# Altium project Thunderscope_Rev3.PrjPCB (part 2 of 2)
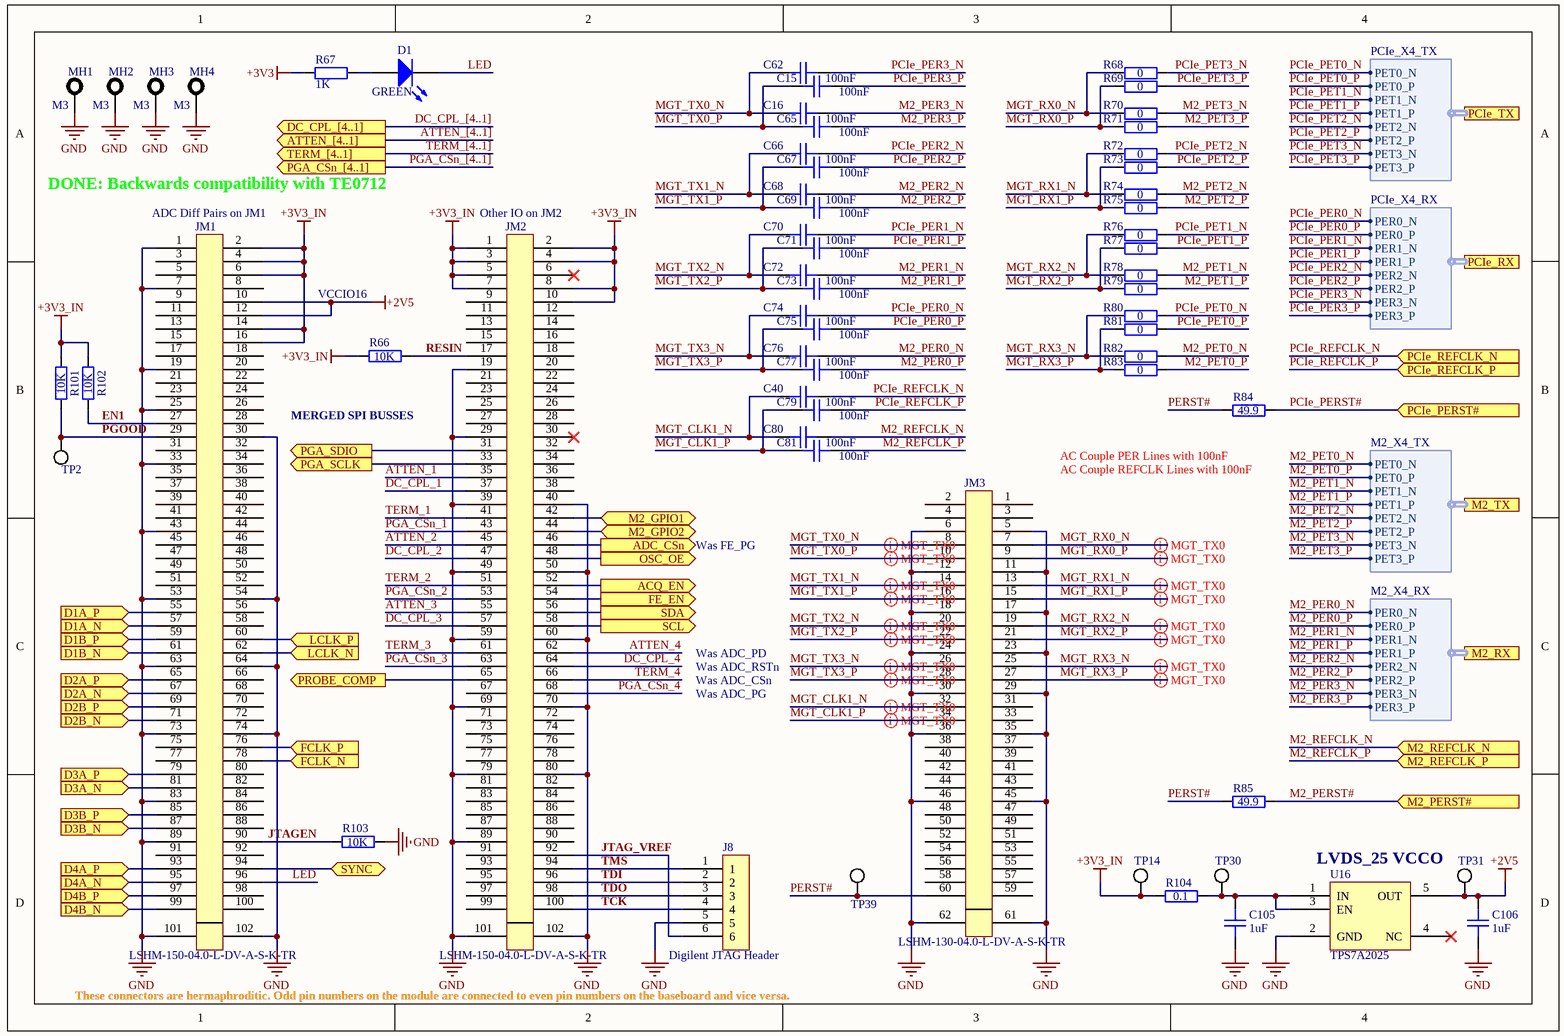
[diagram p5: FPGA.SchDoc]

## Nets that join several sheets
+3V3: Main (7 pins), FE (6 pins), Front End/CH1 (7 pins), Front End/CH2 (7 pins), Front End/CH3 (7 pins), Front End/CH4 (7 pins), ADC (9 pins), FPGA (R67.2)
+3V3_IN: Main (C91.2 U14.1 U14.2 U14.4), FPGA (18 pins)
+5V: FE (16 pins), Front End/CH1 (17 pins), Front End/CH2 (17 pins), Front End/CH3 (17 pins), Front End/CH4 (17 pins)
+5V2: Main (R4.2 TP4.1), FE (R7.1 R8.1 TP13.1)
-5V: FE (5 pins), Front End/CH1 (13 pins), Front End/CH2 (13 pins), Front End/CH3 (13 pins), Front End/CH4 (13 pins)
-VBIAS: FE (TP19.1 U5.2 U5.6), Front End/CH1 (C28A.1 R47A.1), Front End/CH2 (C28B.1 R47B.1), Front End/CH3 (C28C.1 R47C.1), Front End/CH4 (C28D.1 R47D.1)
GND: Main (29 pins), FE (32 pins), Front End/CH1 (46 pins), Front End/CH2 (46 pins), Front End/CH3 (46 pins), Front End/CH4 (46 pins), ADC (34 pins), FPGA (57 pins)
ACQ_EN: Main (R38.2 TP33.1 U14.3), FPGA (JM2.52)
ADC_CSn: ADC (R42.1 TP29.1 U12.2), FPGA (JM2.46)
ADC_SCLK: Front End/CH1 (U7A.11), Front End/CH2 (U7B.11), Front End/CH3 (U7C.11), Front End/CH4 (U7D.11), ADC (TP35.1 U12.4), FPGA (JM2.33)
ADC_SDATA: Front End/CH1 (U7A.10), Front End/CH2 (U7B.10), Front End/CH3 (U7C.10), Front End/CH4 (U7D.10), ADC (TP34.1 U12.3), FPGA (JM2.31)
ATTEN_1: Front End/CH1 (R27A.2 R28A.2 TP25A.1), FPGA (JM2.35)
ATTEN_2: Front End/CH2 (R27B.2 R28B.2 TP25B.1), FPGA (JM2.45)
ATTEN_3: Front End/CH3 (R27C.2 R28C.2 TP25C.1), FPGA (JM2.55)
ATTEN_4: Front End/CH4 (R27D.2 R28D.2 TP25D.1), FPGA (JM2.62)
CH1_N: Front End/CH1 (R40A.2), ADC (R57.2 U12.47)
CH1_P: Front End/CH1 (R30A.2), ADC (R57.1 U12.46)
CH2_N: Front End/CH2 (R40B.2), ADC (R60.2 U12.44)
CH2_P: Front End/CH2 (R30B.2), ADC (R60.1 U12.43)
CH3_N: Front End/CH3 (R40C.2), ADC (R62.2 U12.41)
CH3_P: Front End/CH3 (R30C.2), ADC (R62.1 U12.40)
CH4_N: Front End/CH4 (R40D.2), ADC (R63.2 U12.38)
CH4_P: Front End/CH4 (R30D.2), ADC (R63.1 U12.37)
D1A_N: ADC (U12.10), FPGA (JM1.57)
D1A_P: ADC (U12.9), FPGA (JM1.55)
D1B_N: ADC (U12.12), FPGA (JM1.61)
D1B_P: ADC (U12.11), FPGA (JM1.59)
D2A_N: ADC (U12.14), FPGA (JM1.67)
D2A_P: ADC (U12.13), FPGA (JM1.65)
D2B_N: ADC (U12.16), FPGA (JM1.71)
D2B_P: ADC (U12.15), FPGA (JM1.69)
D3A_N: ADC (U12.22), FPGA (JM1.81)
D3A_P: ADC (U12.21), FPGA (JM1.79)
D3B_N: ADC (U12.24), FPGA (JM1.87)
D3B_P: ADC (U12.23), FPGA (JM1.85)
D4A_N: ADC (U12.26), FPGA (JM1.95)
D4A_P: ADC (U12.25), FPGA (JM1.93)
D4B_N: ADC (U12.28), FPGA (JM1.99)
D4B_P: ADC (U12.27), FPGA (JM1.97)
DC_CPL_1: Front End/CH1 (TP22A.1 U10A.1), FPGA (JM2.37)
DC_CPL_2: Front End/CH2 (TP22B.1 U10B.1), FPGA (JM2.47)
DC_CPL_3: Front End/CH3 (TP22C.1 U10C.1), FPGA (JM2.57)
DC_CPL_4: Front End/CH4 (TP22D.1 U10D.1), FPGA (JM2.64)
FCLK_N: ADC (U12.20), FPGA (JM1.78)
FCLK_P: ADC (U12.19), FPGA (JM1.76)
FE_EN: Main (R6.1 U2.2), FPGA (JM2.54)
LCLK_N: ADC (U12.18), FPGA (JM1.62)
LCLK_P: ADC (U12.17), FPGA (JM1.60)
PGA_CSn_1: Front End/CH1 (R29A.1 TP26A.1 U7A.9), FPGA (JM2.43)
PGA_CSn_2: Front End/CH2 (R29B.1 TP26B.1 U7B.9), FPGA (JM2.53)
PGA_CSn_3: Front End/CH3 (R29C.1 TP26C.1 U7C.9), FPGA (JM2.63)
PGA_CSn_4: Front End/CH4 (R29D.1 TP26D.1 U7D.9), FPGA (JM2.68)
PROBE_COMP: Main (R2.2 U1.2), FPGA (JM2.65)
SCL: FE (Q2.3 R21.1 U18.10), FPGA (JM2.58)
SDA: FE (Q1.3 R20.1 U18.11), FPGA (JM2.56)
SYNC: Main (R108.2 R109.2), FPGA (JM1.94)
TERM_1: Front End/CH1 (R56A.2 R96A.2 TP24A.1), FPGA (JM2.41)
TERM_2: Front End/CH2 (R56B.2 R96B.2 TP24B.1), FPGA (JM2.51)
TERM_3: Front End/CH3 (R56C.2 R96C.2 TP24C.1), FPGA (JM2.61)
TERM_4: Front End/CH4 (R56D.2 R96D.2 TP24D.1), FPGA (JM2.66)
TRIM1: FE (R15.1 U17.1), Front End/CH1 (5 pins)
TRIM2: FE (R17.1 U17.8), Front End/CH2 (5 pins)
TRIM3: FE (R18.1 U17.9), Front End/CH3 (5 pins)
TRIM4: FE (R19.1 U17.14), Front End/CH4 (5 pins)
VCM: FE (TP16.1), Front End/CH1 (U7A.13), Front End/CH2 (U7B.13), Front End/CH3 (U7C.13), Front End/CH4 (U7D.13), ADC (U12.48)